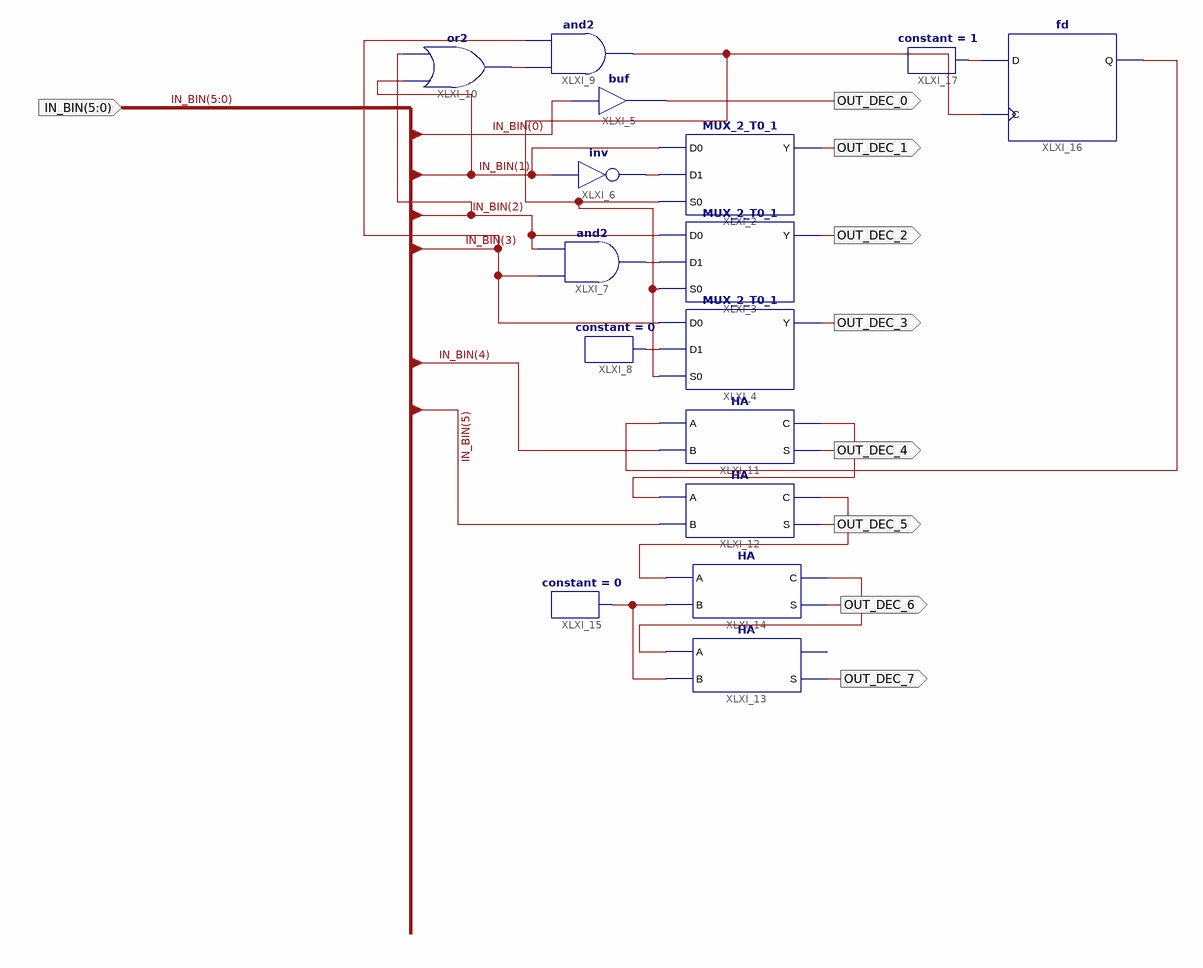
[diagram p0: schematic sheet 1]
// Xilinx ISE schematic CONVERTER.sch (spartan3e) as structural Verilog: 16 symbols, 9 ports
module CONVERTER (
  input  [5:0] IN_BIN,
  output OUT_DEC_0,
  output OUT_DEC_1,
  output OUT_DEC_2,
  output OUT_DEC_3,
  output OUT_DEC_4,
  output OUT_DEC_5,
  output OUT_DEC_6,
  output OUT_DEC_7
);

  wire XLXN_13, XLXN_14, XLXN_16, XLXN_17, XLXN_29, XLXN_30, XLXN_31, XLXN_32, XLXN_44, XLXN_47, XLXN_49;

  MUX_2_T0_1 XLXI_2 (.D0(IN_BIN[1]), .D1(XLXN_13), .S0(XLXN_47), .Y(OUT_DEC_1));
  MUX_2_T0_1 XLXI_3 (.D0(IN_BIN[2]), .D1(XLXN_14), .S0(XLXN_47), .Y(OUT_DEC_2));
  MUX_2_T0_1 XLXI_4 (.D0(IN_BIN[3]), .D1(XLXN_16), .S0(XLXN_47), .Y(OUT_DEC_3));
  buf XLXI_5 (OUT_DEC_0, IN_BIN[0]);
  not XLXI_6 (XLXN_13, IN_BIN[1]);
  and XLXI_7 (XLXN_14, IN_BIN[3], IN_BIN[2]);
  constant #(.CValue("0")) XLXI_8 (.O(XLXN_16));
  and XLXI_9 (XLXN_47, XLXN_17, IN_BIN[3]);
  or XLXI_10 (XLXN_17, IN_BIN[1], IN_BIN[2]);
  HA XLXI_11 (.A(XLXN_49), .B(IN_BIN[4]), .C(XLXN_29), .S(OUT_DEC_4));
  HA XLXI_12 (.A(XLXN_29), .B(IN_BIN[5]), .C(XLXN_30), .S(OUT_DEC_5));
  HA XLXI_13 (.A(XLXN_31), .B(XLXN_32), .S(OUT_DEC_7));  // open: C
  HA XLXI_14 (.A(XLXN_30), .B(XLXN_32), .C(XLXN_31), .S(OUT_DEC_6));
  constant #(.CValue("0")) XLXI_15 (.O(XLXN_32));
  fd XLXI_16 (.C(XLXN_47), .D(XLXN_44), .Q(XLXN_49));
  constant #(.CValue("1")) XLXI_17 (.O(XLXN_44));
endmodule
